# EAGLE design TestRig (EAGLE 6.5.0)
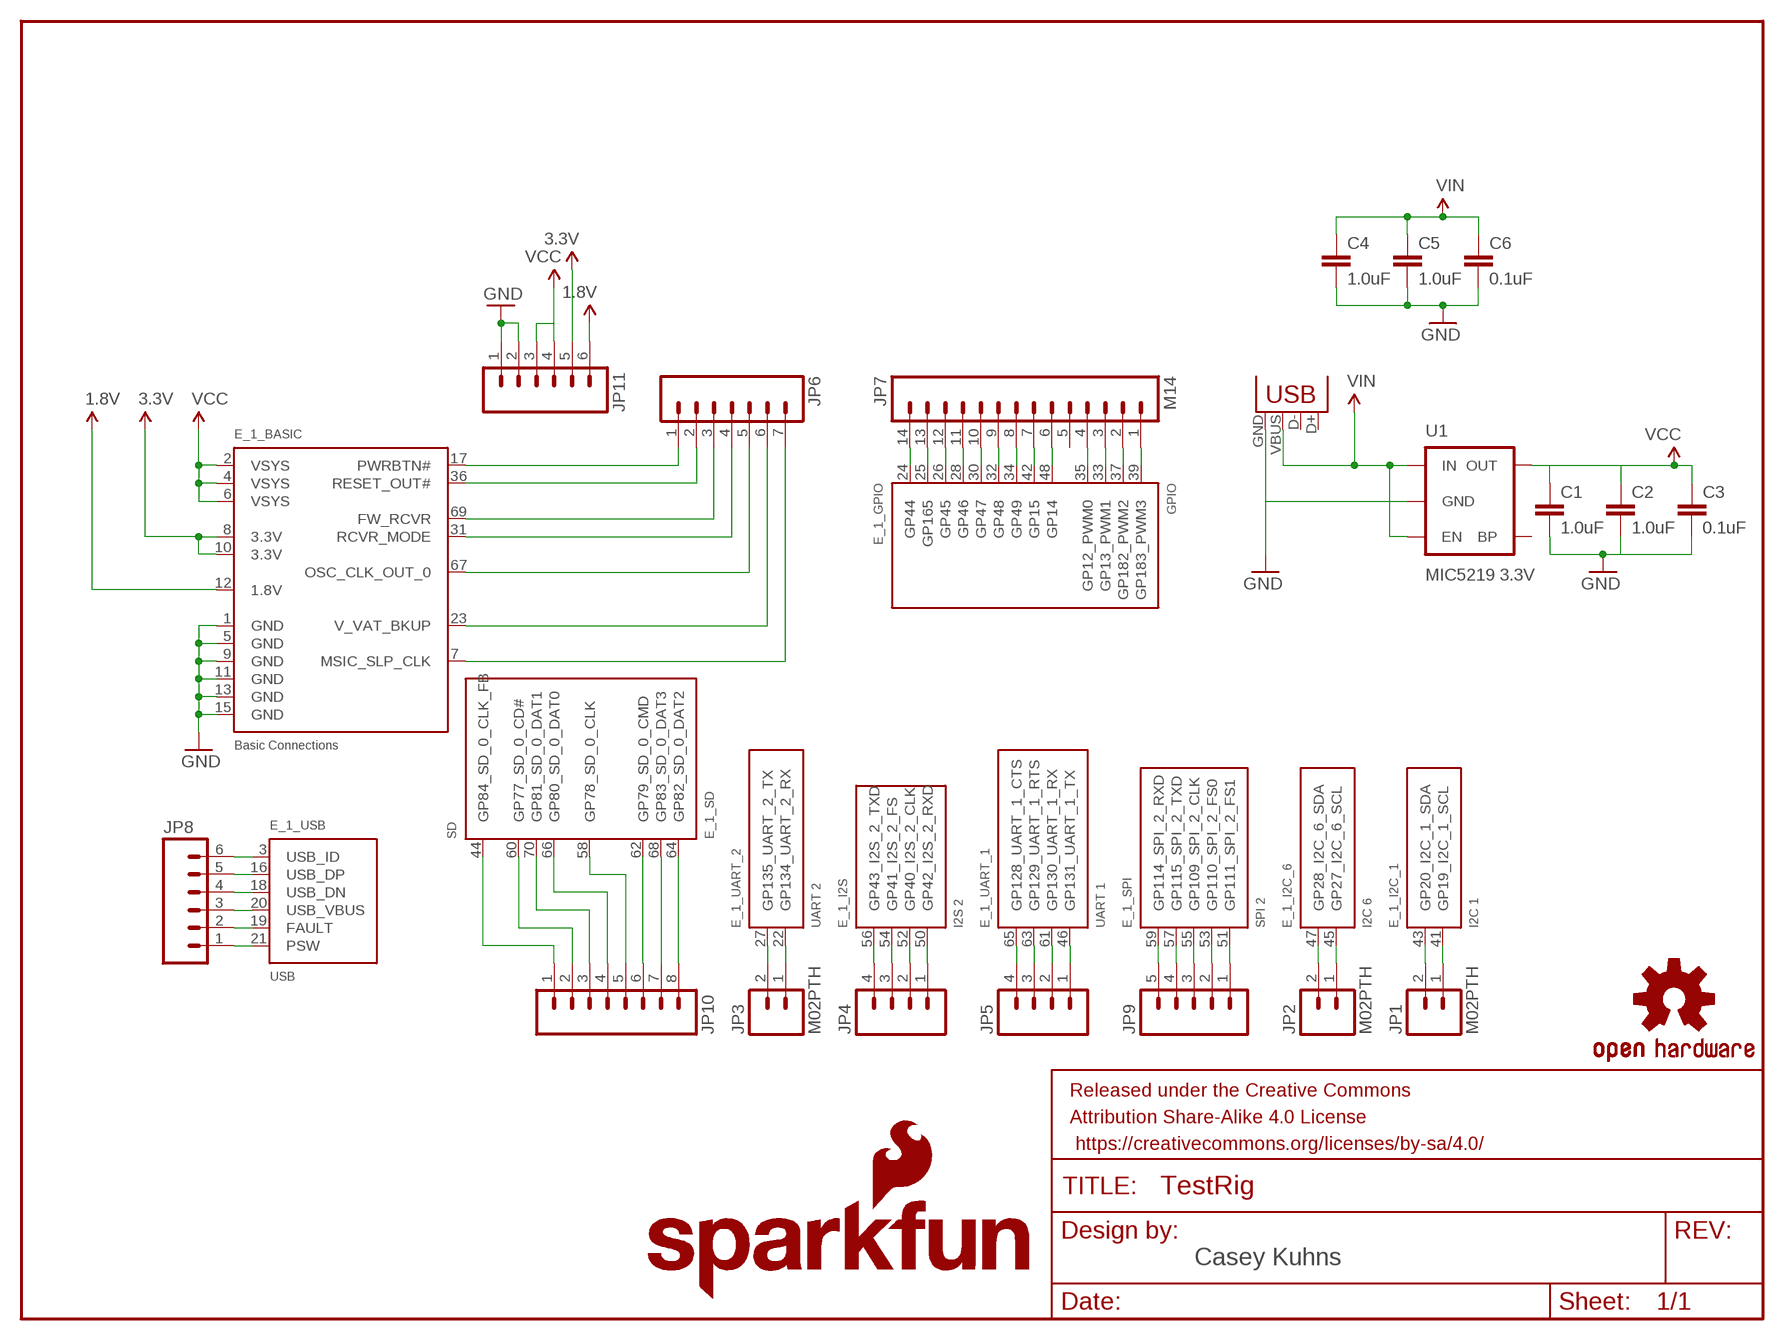
[diagram p0: schematic, sheet 1]

## Parts
C1  1.0uF  1.0UF-25V-+80/-20(0805)  [0805]
C2  1.0uF  1.0UF-25V-+80/-20(0805)  [0805]
C3  0.1uF  0.1UF-25V(+80/-20%)(0603)  [0603-CAP]
C4  1.0uF  1.0UF-25V-+80/-20(0805)  [0805]
C5  1.0uF  1.0UF-25V-+80/-20(0805)  [0805]
C6  0.1uF  0.1UF-25V(+80/-20%)(0603)  [0603-CAP]
E_1  EDISON_CONNECTOR_SEGMENTED  [EDISON_DAUGHTER]
FRAME1  FRAME-LETTER  [CREATIVE_COMMONS]
JP1  M02PTH  [1X02]
JP2  M02PTH  [1X02]
JP3  M02PTH  [1X02]
JP4  M04PTH  [1X04]
JP5  M04PTH  [1X04]
JP6  M07  [1X07]
JP7  M14  [1X14]
JP8  M06SIP  [1X06]
JP9  M05NO_SILK  [1X05_NO_SILK]
JP10  M081X08  [1X08]
JP11  M06SIP  [1X06]
JP12  USBSMD  [USB-MINIB]
LOGO1  SFE_LOGO_NAME_FLAME.1_INCH  [SFE_LOGO_NAME_FLAME_.1]
LOGO2  OSHW-LOGOS  [OSHW-LOGO-S]
U1  MIC5219 3.3V  V_REG_MIC52193.3V  [SOT23-5]

## Nets
1.8V: E_1.12(_BASIC:1.8V) JP11.6
3.3V: E_1.8(_BASIC:3.3V) E_1.10(_BASIC:3.3V) JP11.5
GND: C1.2 C2.2 C3.2 C4.2 C5.2 C6.2 E_1.1(_BASIC:GND) E_1.5(_BASIC:GND) E_1.9(_BASIC:GND) E_1.11(_BASIC:GND) E_1.13(_BASIC:GND) E_1.15(_BASIC:GND) JP11.1 JP11.2 JP12.GND U1.2(GND)
N$1: E_1.41(_I2C_1:GP19_I2C_1_SCL) JP1.1
N$2: E_1.43(_I2C_1:GP20_I2C_1_SDA) JP1.2
N$3: E_1.45(_I2C_6:GP27_I2C_6_SCL) JP2.1
N$4: E_1.47(_I2C_6:GP28_I2C_6_SDA) JP2.2
N$5: E_1.22(_UART_2:GP134_UART_2_RX) JP3.1
N$6: E_1.27(_UART_2:GP135_UART_2_TX) JP3.2
N$7: E_1.50(_I2S:GP42_I2S_2_RXD) JP4.1
N$8: E_1.52(_I2S:GP40_I2S_2_CLK) JP4.2
N$9: E_1.54(_I2S:GP41_I2S_2_FS) JP4.3
N$10: E_1.56(_I2S:GP43_I2S_2_TXD) JP4.4
N$11: E_1.46(_UART_1:GP131_UART_1_TX) JP5.1
N$12: E_1.61(_UART_1:GP130_UART_1_RX) JP5.2
N$13: E_1.63(_UART_1:GP129_UART_1_RTS) JP5.3
N$14: E_1.65(_UART_1:GP128_UART_1_CTS) JP5.4
N$15: E_1.17(_BASIC:PWRBTN#) JP6.1
N$16: E_1.36(_BASIC:RESET_OUT#) JP6.2
N$17: E_1.69(_BASIC:FW_RCVR) JP6.3
N$18: E_1.31(_BASIC:RCVR_MODE) JP6.4
N$19: E_1.67(_BASIC:OSC_CLK_OUT_0) JP6.5
N$20: E_1.23(_BASIC:V_VAT_BKUP) JP6.6
N$21: E_1.7(_BASIC:MSIC_SLP_CLK) JP6.7
N$22: E_1.39(_GPIO:GP183_PWM3) JP7.1
N$23: E_1.37(_GPIO:GP182_PWM2) JP7.2
N$24: E_1.33(_GPIO:GP13_PWM1) JP7.3
N$25: E_1.35(_GPIO:GP12_PWM0) JP7.4
N$26: E_1.48(_GPIO:GP14) JP7.6
N$27: E_1.42(_GPIO:GP15) JP7.7
N$28: E_1.34(_GPIO:GP49) JP7.8
N$29: E_1.32(_GPIO:GP48) JP7.9
N$30: E_1.30(_GPIO:GP47) JP7.10
N$31: E_1.28(_GPIO:GP46) JP7.11
N$32: E_1.26(_GPIO:GP45) JP7.12
N$33: E_1.25(_GPIO:GP165) JP7.13
N$34: E_1.24(_GPIO:GP44) JP7.14
N$35: E_1.21(_USB:PSW) JP8.1
N$36: E_1.19(_USB:FAULT) JP8.2
N$37: E_1.20(_USB:USB_VBUS) JP8.3
N$38: E_1.18(_USB:USB_DN) JP8.4
N$39: E_1.16(_USB:USB_DP) JP8.5
N$40: E_1.3(_USB:USB_ID) JP8.6
N$41: E_1.51(_SPI:GP111_SPI_2_FS1) JP9.1
N$42: E_1.53(_SPI:GP110_SPI_2_FS0) JP9.2
N$43: E_1.55(_SPI:GP109_SPI_2_CLK) JP9.3
N$44: E_1.57(_SPI:GP115_SPI_2_TXD) JP9.4
N$45: E_1.59(_SPI:GP114_SPI_2_RXD) JP9.5
N$46: E_1.64(_SD:GP82_SD_0_DAT2) JP10.8
N$47: E_1.68(_SD:GP83_SD_0_DAT3) JP10.7
N$48: E_1.62(_SD:GP79_SD_0_CMD) JP10.6
N$49: E_1.58(_SD:GP78_SD_0_CLK) JP10.5
N$50: E_1.66(_SD:GP80_SD_0_DAT0) JP10.4
N$51: E_1.70(_SD:GP81_SD_0_DAT1) JP10.3
N$52: E_1.60(_SD:GP77_SD_0_CD#) JP10.2
N$53: E_1.44(_SD:GP84_SD_0_CLK_FB) JP10.1
VCC: C1.1 C2.1 C3.1 E_1.2(_BASIC:VSYS) E_1.4(_BASIC:VSYS) E_1.6(_BASIC:VSYS) JP11.3 JP11.4 U1.5(OUT)
VIN: C4.1 C5.1 C6.1 JP12.VBUS U1.1(IN) U1.3(EN)
Unconnected: JP7.5 JP12.D+ JP12.D- U1.4(BP)

## Notes on the sheet
- Casey Kuhns

## Library data of the parts
C1 C2 C4 C5 = SparkFun-Capacitors:1.0UF-25V-+80/-20(0805): CAP-11625; PROD_ID: CAP-11625
C3 C6 = SparkFun-Capacitors:0.1UF-25V(+80/-20%)(0603): CAP-00810 Ceramic Standard decoupling cap; PROD_ID: CAP-00810
E_1 = Edison_Connectors:EDISON_CONNECTOR_SEGMENTED
FRAME1 = SparkFun-Aesthetics:FRAME-LETTER: Schematic Frame Standard 8.5x11 US Letter frame
JP1-JP3 = SparkFun-Connectors:M02: Standard 2-pin 0.1" header. Use with - straight break away headers ( PRT-00116) - right angle break away headers (PRT-00553) - swiss pins (PRT-00743) - machine pins (PRT-00117) - female headers (PRT-00115) Molex polarized connector foot print use with: PRT-08233 with associated crimp pins and housings. 2.54_SCREWTERM for use with PRT-10571. 3.5mm Screw Terminal footprints for PRT-08084 5mm Screw Terminal footprints for use with PRT-08433
JP4 JP5 = SparkFun-Connectors:M04: Header 4 Standard 4-pin 0.1" header. Use with straight break away headers (SKU : PRT-00116), right angle break away headers (PRT-00553), swiss pins (PRT-00743), machine pins (PRT-00117), and female headers (PRT-00115). Molex polarized connector foot print use with SKU : PRT-08231 with associated crimp pins and housings. 1MM SMD Version SKU: PRT-10208
JP6 = SparkFun-Connectors:M07: Header 7 Standard 7-pin 0.1" header. Use with straight break away headers (SKU : PRT-00116), right angle break away headers (PRT-00553), swiss pins (PRT-00743), machine pins (PRT-00117), and female headers (PRT-00115). NOTES ON THE VARIANTS LOCK and LOCK_LONGPADS... This footprint was designed to help hold the alignment of a through-hole component (i.e. 7-pin header) while soldering it into place. You may notice that each hole has been shifted either up or down by 0.005 of an inch from it's more standard position (which is usually a perfectly straight line). This slight alteration caused the pins (the squares in the middle) to touch the edges of the holes. Because they are alternating, it causes a "brace" to hold the header in place. 0.005 has proven to be the perfect amount of "off-center" position when using our standard breakaway headers. Although looks a little odd when you look at the bare footprint, once you have a header in there, the alteration is very hard to notice. Also, if you push a header all the way into place, it is covered up entirely on the bottom side. This idea of altering the position of holes to aid alignment will be further integrated into the Sparkfun Library for other footprints. It can help hold any component with 3 or more connection pins.
JP7 = SparkFun-Connectors:M14: Header 14 Standard 14-pin 0.1" header. Use with straight break away headers (SKU : PRT-00116), right angle break away headers (PRT-00553), swiss pins (PRT-00743), machine pins (PRT-00117), and female headers (PRT-00115).
JP8 JP11 = SparkFun-Connectors:M06: Header 6 Standard 6-pin 0.1" header. Use with straight break away headers (SKU : PRT-00116), right angle break away headers (PRT-00553), swiss pins (PRT-00743), machine pins (PRT-00117), and female headers (PRT-00115). Molex polarized connector foot print use with SKU : PRT-08094 with associated crimp pins and housings. NOTES ON THE VARIANTS LOCK and LOCK_LONGPADS... This footprint was designed to help hold the alignment of a through-hole component (i.e. 6-pin header) while soldering it into place. You may notice that each hole has been shifted either up or down by 0.005 of an inch from it's more standard position (which is a perfectly straight line). This slight alteration caused the pins (the squares in the middle) to touch the edges of the holes. Because they are alternating, it causes a "brace" to hold the component in place. 0.005 has proven to be the perfect amount of "off-center" position when using our standard breakaway headers. Although looks a little odd when you look at the bare footprint, once you have a header in there, the alteration is very hard to notice. Also,if you push a header all the way into place, it is covered up entirely on the bottom side. This idea of altering the position of holes to aid alignment will be further integrated into the Sparkfun Library for other footprints. It can help hold any component with 3 or more connection pins.
JP9 = SparkFun-Connectors:M05: Header 5 Standard 5-pin 0.1" header. Use with straight break away headers (SKU : PRT-00116), right angle break away headers (PRT-00553), swiss pins (PRT-00743), machine pins (PRT-00117), and female headers (PRT-00115). Molex polarized connector foot print use with SKU : PRT-08230 with associated crimp pins and housings.
JP10 = SparkFun-Connectors:M08: Header 8 Standard 8-pin 0.1" header. Use with straight break away headers (SKU : PRT-00116), right angle break away headers (PRT-00553), swiss pins (PRT-00743), machine pins (PRT-00117), and female headers (PRT-00115).
JP12 = SparkFun-Connectors:USB: USB Connectors USB-B-PTH is fully proven SKU : PRT-00139/CONN-08278 USB-miniB is fully proven SKU : PRT-00587 USB-A-PCB is untested. USB-A-H is throughly reviewed, but untested. Spark Fun Electronics SKU : PRT-00437 USB-B-SMT is throughly reviewed, but untested. Needs silkscreen touching up. USB-A-S has not been used/tested USB-MB-H has not been used/tested USB-MICROB has been used. CONN-09505; PROD_ID: CONN-08193
LOGO1 = SparkFun-Aesthetics:SFE_LOGO_NAME_FLAME: SFE Logo, name and flame This is the SparkFun full logo. The logo on the schematic will always be the same size; the package variant is the height of the flame part of the logo. Default layer for the logo on the board is tSilk.
LOGO2 = SparkFun-Aesthetics:OSHW-LOGO: Open Source Hardware Logo This logo indicates the piece of hardware it is found on incorporates a OSHW license and/or adheres to the definition of open source hardware found here: http://freedomdefined.org/OSHW
U1 = SparkFun-PowerIC:V_REG_MIC5219: V_REG MIC5219 Standard 3.3V and 5V 500mA LDO voltage regulator in SOT-23 layout. Micrel part MIC5219. BP (by-pass) pin is used to lower output noise with 470pF cap, may be left open.; PROD_ID: VREG-09872

## Board
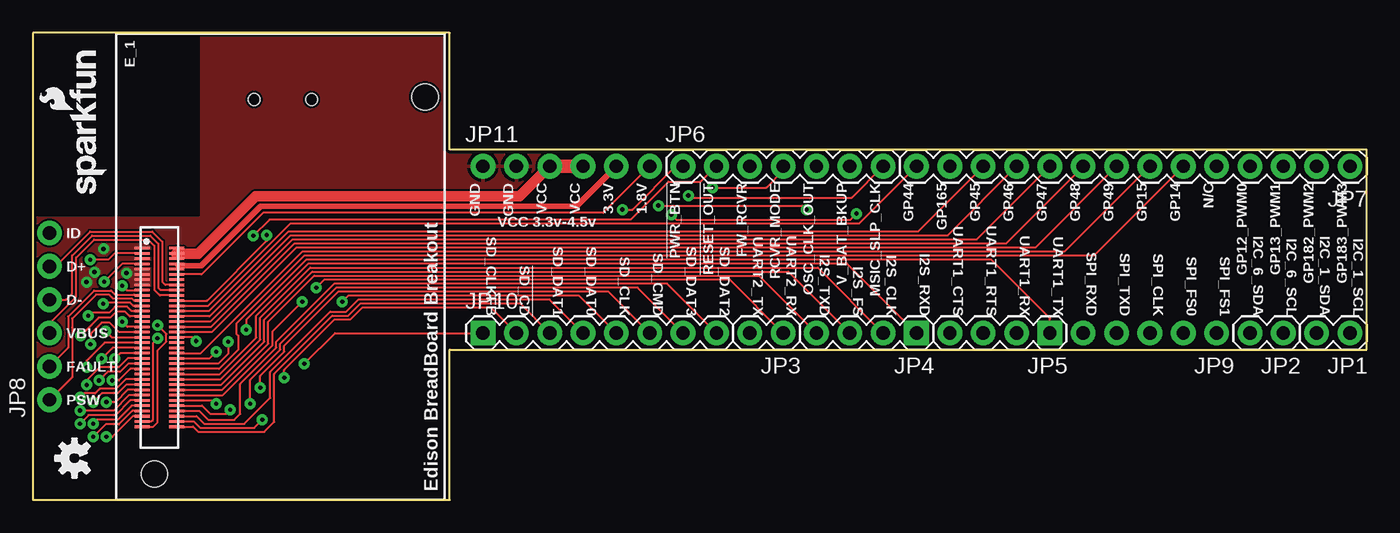
[diagram p1: board, top side]
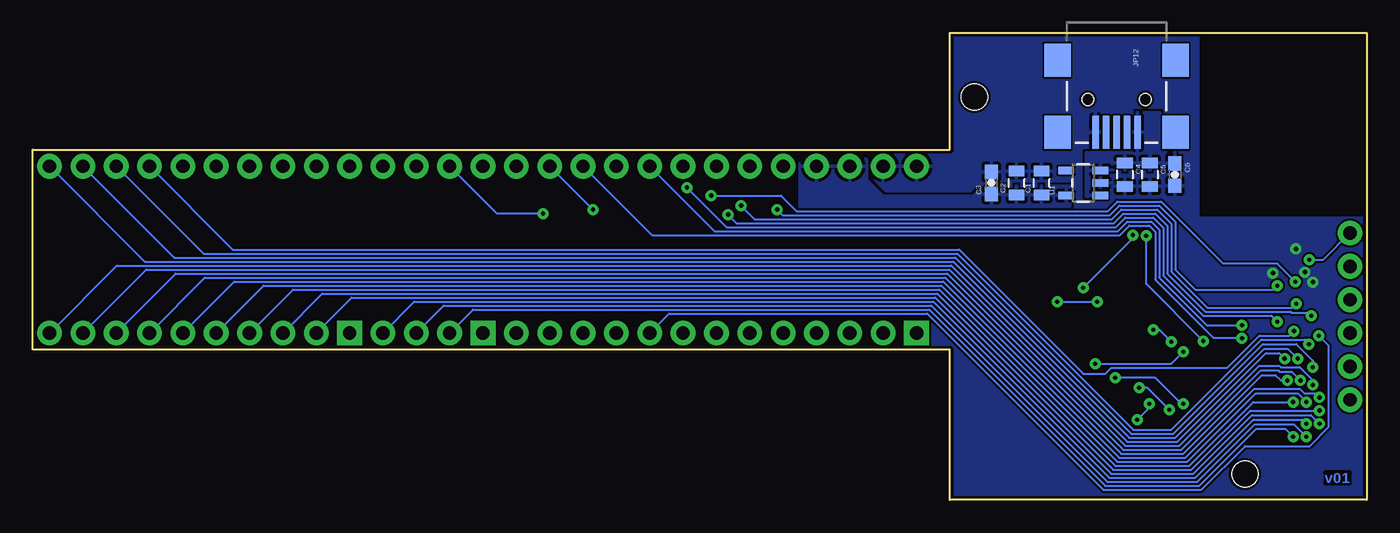
[diagram p2: board, bottom side, seen from below]

Size 101.6 x 35.56 mm. Coordinates in mm from the lower left corner, seen from the top.
Outline: 0,0 31.75,0 31.75,11.43 101.6,11.43 101.6,26.67 31.75,26.67 31.75,35.56 0,35.56 0,0
Copper layers (1*16): Top 0.035mm / dielectric 1.5mm / Bottom 0.035mm
Design rules "SparkFun-2-layer *": minimum track width 6mil, minimum drill 13mil, track to track 6mil, track to pad 6mil, pad to pad 6mil, via to via 6mil, smd to smd 6mil, copper to edge 8mil, drill to drill 8mil, minimum pad ring 12mil, minimum via ring 10mil, stop-mask expansion 4mil, vias tented up to drill 20mil, thermal gap 10mil
tRestrict: area 0,21.6 to 12.7,35.6
bRestrict: area 0,21.6 to 12.7,35.6

### Footprints (pad centres in the part's own frame; a part is rotated, then mirrored left to right if it is on the bottom)
0805 = smd 0.8 x 1.2: 1 -0.9,0; 2 0.9,0
0603-CAP = smd 1.1 x 1: 1 -0.85,0; 2 0.85,0
EDISON_DAUGHTER = smd 1.14 x 0.2: 1 1.98,19.17; 2 4.62,19.17; 3 1.98,18.77; 4 4.62,18.77; 5 1.98,18.37; 6 4.62,18.37; 7 1.98,17.97; 8 4.62,17.97; 9 1.98,17.57; 10 4.62,17.57; 11 1.98,17.17; 12 4.62,17.17; 13 1.98,16.77; 14 4.62,16.77; 15 1.98,16.37; 16 4.62,16.37; 17 1.98,15.97; 18 4.62,15.97; 19 1.98,15.57; 20 4.62,15.57; 21 1.98,15.17; 22 4.62,15.17; 23 1.98,14.77; 24 4.62,14.77; 25 1.98,14.37; 26 4.62,14.37; 27 1.98,13.97; 28 4.62,13.97; 29 1.98,13.57; 30 4.62,13.57; 31 1.98,13.17; 32 4.62,13.17; 33 1.98,12.77; 34 4.62,12.77; 35 1.98,12.37; 36 4.62,12.37; 37 1.98,11.97; 38 4.62,11.97; 39 1.98,11.57; 40 4.62,11.57; 41 1.98,11.17; 42 4.62,11.17; 43 1.98,10.77; 44 4.62,10.77; 45 1.98,10.37; 46 4.62,10.37; 47 1.98,9.97; 48 4.62,9.97; 49 1.98,9.57; 50 4.62,9.57; 51 1.98,9.17; 52 4.62,9.17; 53 1.98,8.77; 54 4.62,8.77; 55 1.98,8.37; 56 4.62,8.37; 57 1.98,7.97; 58 4.62,7.97; 59 1.98,7.57; 60 4.62,7.57; 61 1.98,7.17; 62 4.62,7.17; 63 1.98,6.77; 64 4.62,6.77; 65 1.98,6.37; 66 4.62,6.37; 67 1.98,5.97; 68 4.62,5.97; 69 1.98,5.57; 70 4.62,5.57 | hole 2: 23.53,30.67; 2.93,1.98
1X02 = drill 1.016 pad 1.88: 1 0,0; 2 2.54,0
1X04 = drill 1.016 pad 1.88 square: 1 0,0 | drill 1.016 pad 1.88: 2 2.54,0; 3 5.08,0; 4 7.62,0
1X07 = drill 1.016 pad 1.88: 1 0,0; 2 2.54,0; 3 5.08,0; 4 7.62,0; 5 10.16,0; 6 12.7,0; 7 15.24,0
1X14 = drill 1.016 pad 1.88: 1 0,0; 2 2.54,0; 3 5.08,0; 4 7.62,0; 5 10.16,0; 6 12.7,0; 7 15.24,0; 8 17.78,0; 9 20.32,0; 10 22.86,0; 11 25.4,0; 12 27.94,0; 13 30.48,0; 14 33.02,0
1X06 = drill 1.016 pad 1.88: 1 0,0; 2 2.54,0; 3 5.08,0; 4 7.62,0; 5 10.16,0; 6 12.7,0
1X05_NO_SILK = drill 1.016 pad 1.88: 1 0,0; 2 2.54,0; 3 5.08,0; 4 7.62,0; 5 10.16,0
1X08 = drill 1.016 pad 1.88 square: 1 0,0 | drill 1.016 pad 1.88: 2 2.54,0; 3 5.08,0; 4 7.62,0; 5 10.16,0; 6 12.7,0; 7 15.24,0; 8 17.78,0
USB-MINIB = smd 2.5 x 0.5: D+ 2.5,0; D- 2.5,0.8; GND 2.5,-1.6; ID 2.5,-0.8; VBUS 2.5,1.6 | smd 2.5 x 2: MTN1 -3,4.5; MTN2 2.5,4.5; MTN3 -3,-4.5; MTN4 2.5,-4.5 | hole 0.9: 0,2.2; 0,-2.2
SOT23-5 = smd 0.55 x 1.2: 1 -0.95,-1.3; 2 0,-1.3; 3 0.95,-1.3; 4 0.95,1.3; 5 -0.95,1.3

### Placement (x,y rotation side)
C1  24.77,24.13 90 bottom
C2  26.67,24.13 90 bottom
C3  28.57,24.13 90 bottom
C4  18.41,24.77 270 bottom
C5  16.51,24.77 270 bottom
C6  14.61,24.77 270 bottom
E_1  6.35,0 0 top
FRAME1  0,-10.16 0 top  (outside the outline)
JP1  100.33,12.7 180 top
JP2  95.25,12.7 180 top
JP3  57.15,12.7 180 top
JP4  67.31,12.7 180 top
JP5  77.47,12.7 180 top
JP6  49.53,25.4 0 top
JP7  100.33,25.4 180 top
JP8  1.27,7.62 90 top
JP9  90.17,12.7 180 top
JP10  34.29,12.7 0 top
JP11  34.29,25.4 0 top
JP12  19.05,30.48 270 bottom
LOGO1  5.71,22.86 90 top
LOGO2  3.17,3.17 90 top
U1  21.59,24.13 90 bottom

### Tracks (layer width: path | path; a pad name or v marks a point on that pad's centre or on a via)
1.8V
  Top 0.152: JP11.6 43.43,21.84 17.53,21.84 12.85,17.17 E_1.12
3.3V
  Top 0.152: E_1.8 E_1.10 | E_1.8 10.97,17.83 | E_1.8 10.97,17.93 11.07,17.83
  Top 0.406: JP11.5 41.4,22.35 17.35,22.35 12.83,17.83 11.07,17.83
GND  (via drill 0.33)
  other vias: 5.38,19.1 7.14,17.27 4.7,17.35 4.09,16.59
  pour Top (no thermals): 7.11,19.56 9.4,19.56 9.4,15.75 7.11,15.75
  pour Top: 0,0 31.75,0 31.75,11.43 101.6,11.43 101.6,26.67 31.75,26.67 31.75,35.56 0,35.56
  pour Bottom (rank 6): 0,-0.05 31.75,-0.05 31.75,11.38 101.6,11.38 101.6,26.62 31.75,26.62 31.75,35.51 0,35.51
N$1  (via drill 0.33)
  Top 0.152: E_1.41 6.67,11.17 v6.25,10.75
  Bottom 0.152: JP1.1 95.2,17.83 31.65,17.83 18.24,4.42 14.43,4.42 7.68,11.17 6.67,11.17 v6.25,10.75
N$2  (via drill 0.33)
  Top 0.152: E_1.43 7.22,10.77 6.55,10.1 5.1,10.1 4.1,9.1 v4.1,8.75
  Bottom 0.152: JP1.2 92.96,17.53 31.8,17.53 18.39,4.12 14.28,4.12 8.19,10.2 6.65,10.2 6.55,10.1 5.1,10.1 4.1,9.1 v4.1,8.75
N$3  (via drill 0.33)
  Top 0.152: E_1.45 7.27,10.37 6.65,9.75 5.7,9.75 v5.05,9.1
  Bottom 0.152: JP2.1 90.73,17.22 31.95,17.22 18.54,3.81 14.12,3.81 8.08,9.85 6.75,9.85 6.65,9.75 5.7,9.75 v5.05,9.1
N$4  (via drill 0.33)
  Top 0.152: E_1.47 7.42,9.97 6.55,9.1 v6.05,9.1
  Bottom 0.152: JP2.2 88.49,16.92 32.11,16.92 18.69,3.5 13.97,3.5 7.97,9.5 6.95,9.5 6.55,9.1 v6.05,9.1
N$5  (via drill 0.33)
  Top 0.152: E_1.22 13.27,15.17 17.82,19.71 v17.82,20.15 | JP3.1 53.09,16.76 22.2,16.76 v21.59,16.15
  Bottom 0.152: v17.82,20.15 17.82,19.93 v21.59,16.15
N$6  (via drill 0.33)
  Top 0.152: E_1.27 7.39,13.97 7.04,14.33 6.35,14.33 5.89,13.87 5.02,13.87 v3.65,12.5
  Bottom 0.152: JP3.2 53.14,14.17 33.48,14.17 20.07,0.76 12.6,0.76 9.26,4.1 4.35,4.1 2.9,5.55 2.9,11.75 v3.65,12.5
N$7
  Top 0.152: E_1.50 14.24,9.57 17.02,12.34 17.02,14.02 20.98,17.98 62.03,17.98 JP4.1
N$8
  Top 0.152: E_1.52 14.3,9.17 17.32,12.19 17.32,13.87 21.13,17.68 59.79,17.68 JP4.2
N$9
  Top 0.152: E_1.54 14.36,8.77 17.63,12.04 17.63,13.72 21.29,17.37 57.56,17.37 JP4.3
N$10
  Top 0.152: E_1.56 14.41,8.37 17.93,11.89 17.93,13.56 21.44,17.07 55.32,17.07 JP4.4
N$11  (via drill 0.33)
  Top 0.152: JP5.1 77.47,13.82 73,18.29 20.83,18.29 16.26,13.72 v16.26,12.95 | E_1.46 14.13,10.37 14.88,11.12 v14.88,12.04
  Bottom 0.152: v16.26,12.95 15.8,12.95 v14.88,12.04
N$12  (via drill 0.33)
  Top 0.152: E_1.61 7.52,7.17 6.45,6.1 4.9,6.1 v4.6,5.8
  Bottom 0.152: JP5.2 72.54,15.09 33.02,15.09 19.61,1.68 13.06,1.68 8.63,6.1 4.9,6.1 v4.6,5.8
N$13  (via drill 0.33)
  Top 0.152: E_1.63 7.57,6.77 6.55,5.75 5.55,5.75 v4.6,4.8
  Bottom 0.152: JP5.3 70.31,14.78 33.17,14.78 19.76,1.37 12.9,1.37 8.53,5.75 5.55,5.75 v4.6,4.8
N$14  (via drill 0.33)
  Top 0.152: E_1.65 7.62,6.37 6.05,4.8 v5.6,4.8
  Bottom 0.152: JP5.4 68.07,14.48 33.33,14.48 19.91,1.07 12.75,1.07 8.42,5.4 6.2,5.4 v5.6,4.8
N$15  (via drill 0.33)
  Top 0.152: v44.91,22.1 45.67,22.1 48.97,25.4 JP6.1 | v6.81,16.31 7.14,15.97 E_1.17
  Bottom 0.152: v44.91,22.1 44.45,21.64 19.61,21.64 18.85,22.4 15.8,22.4 14.58,21.18 14.58,17.53 13.06,16 7.11,16 v6.81,16.31
N$16  (via drill 0.33)
  Top 0.152: v12.45,12.09 12.16,12.37 E_1.36 | v16.8,20.1 18.03,21.34 45.52,21.34 48.41,24.23 50.85,24.23 52.07,25.45 JP6.2
  Bottom 0.152: v12.45,12.09 16.8,16.44 v16.8,20.1
N$17  (via drill 0.33)
  Top 0.152: 7.91,5.57 E_1.69 9.17,5.57 9.5,5.9 9.5,11.38 10.16,12.04 10.16,12.64 v9.5,13.3
  Bottom 0.152: JP6.3 49.63,20.42 19,20.42 18.24,21.18 16.41,21.18 15.8,20.57 15.8,16.92 12.18,13.3 v9.5,13.3
N$18  (via drill 0.33)
  Top 0.152: v51.77,23.77 55.88,23.77 57.15,25.04 JP6.4 | E_1.31 7.2,13.17 v6.81,13.56
  Bottom 0.152: v51.77,23.77 48.72,20.73 19.15,20.73 18.39,21.49 16.26,21.49 15.49,20.73 15.49,17.07 12.45,14.02 7.26,14.02 v6.81,13.56
N$19  (via drill 0.33)
  Top 0.152: E_1.67 9.02,5.97 9.15,6.1 9.15,11.95 v9.5,12.3
  Bottom 0.152: JP6.5 54.41,20.12 18.85,20.12 18.09,20.88 16.56,20.88 16.1,20.42 16.1,16.76 11.68,12.34 9.54,12.34 v9.5,12.3
N$20  (via drill 0.33)
  Top 0.152: E_1.23 7.66,14.77 7.42,15.01 5.44,15.01 v5.36,14.94 | v47.65,22.4 58.62,22.4 v58.93,22.1
  Bottom 0.152: v58.93,22.1 JP6.6 | v47.65,22.4 46.58,21.34 19.46,21.34 18.69,22.1 15.95,22.1 14.88,21.03 14.88,17.37 12.14,14.63 5.66,14.63 v5.36,14.94
N$21  (via drill 0.33)
  Top 0.152: JP6.7 62.38,23.01 50.09,23.01 v49.94,23.16 | E_1.7 6.79,17.97 v5.44,16.61
  Bottom 0.152: v49.94,23.16 44.6,23.16 43.38,21.95 19.76,21.95 19,22.71 15.65,22.71 10.92,17.98 6.81,17.98 v5.44,16.61
N$22  (via drill 0.33)
  Top 0.152: E_1.39 6.07,11.57 v5.25,10.75
  Bottom 0.152: JP7.1 93.07,18.14 31.5,18.14 18.09,4.72 14.58,4.72 7.8,11.5 6,11.5 v5.25,10.75
N$23  (via drill 0.33)
  Top 0.152: E_1.37 5.47,11.97 4.1,10.6 v4.1,10.1
  Bottom 0.152: JP7.2 90.83,18.44 31.34,18.44 17.93,5.03 14.73,5.03 7.91,11.85 5.35,11.85 4.1,10.6 v4.1,10.1
N$24  (via drill 0.33)
  Top 0.152: E_1.33 6.57,12.77 5.84,13.5 5.24,13.5 4.4,12.66 v4.4,11.85
  Bottom 0.152: JP7.3 88.59,18.75 31.19,18.75 17.78,5.33 14.88,5.33 8.03,12.19 4.71,12.19 4.4,11.88 v4.4,11.85
N$25  (via drill 0.33)
  Top 0.152: v5.54,12.85 6.02,12.37 E_1.35
  Bottom 0.152: JP7.4 86.36,19.05 31.04,19.05 21.59,9.6 19.91,9.6 19.46,10.06 10.62,10.06 8.18,12.5 5.89,12.5 v5.54,12.85
N$26
  Top 0.152: E_1.48 14.19,9.97 15.65,11.43 15.65,12.5 15.49,12.65 15.49,13.41 20.68,18.59 80.82,18.59 JP7.6
N$27
  Top 0.152: JP7.7 78.59,18.9 20.52,18.9 12.8,11.17 E_1.42
N$28
  Top 0.152: JP7.8 76.35,19.2 20.07,19.2 13.63,12.77 E_1.34
N$29
  Top 0.152: JP7.9 74.12,19.51 19.91,19.51 13.58,13.17 E_1.32
N$30
  Top 0.152: JP7.10 71.88,19.81 19.76,19.81 13.52,13.57 E_1.30
N$31
  Top 0.152: JP7.11 69.65,20.12 19.61,20.12 13.46,13.97 E_1.28
N$32
  Top 0.152: JP7.12 67.41,20.42 19.46,20.42 13.4,14.37 E_1.26
N$33  (via drill 0.33)
  Top 0.152: v48.64,21.72 49.02,21.34 62.28,21.34 v62.74,21.79 | E_1.25 7.53,14.37 7.19,14.71 6.27,14.71 5.82,14.25 4.45,14.25 v4.22,14.02
  Bottom 0.152: JP7.13 66.24,21.79 v62.74,21.79 | v48.64,21.72 47.95,21.03 19.3,21.03 18.54,21.79 16.1,21.79 15.19,20.88 15.19,17.22 12.29,14.33 5.82,14.33 5.74,14.25 4.45,14.25 v4.22,14.02
N$34
  Top 0.152: JP7.14 62.94,21.03 19.61,21.03 13.35,14.77 E_1.24
N$35
  Top 0.152: 3,13.11 | 3,13.11 3,9.35 JP8.1 | E_1.21 7.71,15.17 7.57,15.32 6.12,15.32 5.82,15.62 4.83,15.62 3,13.79 3,13.11
N$36
  Top 0.152: JP8.2 2.69,11.58 2.69,13.95 4.67,15.93 5.97,15.93 6.27,15.62 7.72,15.62 7.77,15.57 E_1.19
N$37
  Top 0.152: E_1.20 9.68,15.57 9.25,16 9.25,19.36 8.79,19.81 4.67,19.81 3.3,18.44 3.3,15.47 1.27,13.44 JP8.3
N$38
  Top 0.152: JP8.4 2.54,15.24 3,15.7 3,18.59 4.52,20.12 8.94,20.12 9.55,19.51 9.55,16.15 9.73,15.97 E_1.18
N$39
  Top 0.152: JP8.5 1.73,17.78 4.37,20.42 9.09,20.42 9.86,19.66 9.86,16.61 10.1,16.37 E_1.16
N$40  (via drill 0.33)
  Top 0.152: E_1.3 6.22,18.77 5.74,18.29 v4.37,18.29
  Bottom 0.152: v4.37,18.29 3.3,18.29 JP8.6
N$41  (via drill 0.33)
  Top 0.152: E_1.51 7.07,9.17 6.35,8.45 5.1,8.45 4.75,8.1 3.9,8.1 v3.6,7.8
  Bottom 0.152: JP9.1 86.26,16.61 32.26,16.61 18.85,3.2 13.82,3.2 8.57,8.45 5.1,8.45 4.75,8.1 3.9,8.1 v3.6,7.8
N$42  (via drill 0.33)
  Top 0.152: E_1.53 7.12,8.77 6.45,8.1 5.25,8.1 v4.6,7.45
  Bottom 0.152: JP9.2 84.02,16.31 32.41,16.31 19,2.9 13.66,2.9 8.46,8.1 5.25,8.1 v4.6,7.45
N$43  (via drill 0.33)
  Top 0.152: E_1.55 7.22,8.37 6.3,7.45 v5.6,7.45
  Bottom 0.152: JP9.3 81.79,16 32.56,16 19.15,2.59 13.51,2.59 8.65,7.45 v5.6,7.45
N$44  (via drill 0.33)
  Top 0.152: E_1.57 7.32,7.97 6.15,6.8 v3.6,6.8
  Bottom 0.152: JP9.4 79.55,15.7 32.72,15.7 19.3,2.29 13.36,2.29 8.85,6.8 v3.6,6.8
N$45  (via drill 0.33)
  Top 0.152: E_1.59 7.42,7.57 6.3,6.45 4.25,6.45 v3.6,5.8
  Bottom 0.152: JP9.5 77.32,15.39 32.87,15.39 19.46,1.98 13.21,1.98 8.74,6.45 4.25,6.45 v3.6,5.8
N$46
  Top 0.152: JP10.8 48.31,16.46 22.96,16.46 18.54,12.04 18.54,11.58 15.8,8.84 15.8,6.55 15.34,6.1 13.36,6.1 12.69,6.77 E_1.64
N$47  (via drill 0.33)
  Top 0.152: JP10.7 46.08,16.15 23.11,16.15 18.85,11.89 18.85,11.43 16.56,9.14 v16.56,7.32 | E_1.68 12.27,5.97 12.75,5.49 16.87,5.49 v17.48,6.1
  Bottom 0.152: v17.48,6.1 16.56,7.01 v16.56,7.32
N$48  (via drill 0.33)
  Top 0.152: JP10.6 43.84,15.85 23.27,15.85 19.15,11.73 19.15,11.28 17.32,9.45 v17.32,8.53 | E_1.62 12.9,7.17 13.51,6.55 14.73,6.55 v15.04,6.86
  Bottom 0.152: v15.04,6.86 16.71,8.53 v17.32,8.53
N$49  (via drill 0.33)
  Top 0.152: JP10.5 41.6,15.54 24.03,15.54 v23.57,15.09 | E_1.58 14.47,7.97 18.24,11.73 18.24,12.8 v20.52,15.09
  Bottom 0.152: v23.57,15.09 v20.52,15.09
N$50
  Top 0.152: JP10.4 39.37,15.24 24.79,15.24 23.88,14.33 22.66,14.33 18.09,9.75 18.09,7.77 16.1,5.79 13.06,5.79 12.48,6.37 E_1.66
N$51
  Top 0.152: JP10.3 37.13,14.94 24.94,14.94 24.03,14.02 22.81,14.02 18.39,9.6 18.39,5.94 17.63,5.18 12.6,5.18 12.21,5.57 E_1.70
N$52  (via drill 0.33)
  Top 0.152: JP10.2 34.9,14.63 25.09,14.63 24.18,13.72 22.96,13.72 19.15,9.91 v19.15,9.3 | E_1.60 13.71,7.57 v13.97,7.32
  Bottom 0.152: v13.97,7.32 14.12,7.32 16.1,9.3 v19.15,9.3
N$53  (via drill 0.33)
  Top 0.152: E_1.44 13.46,10.77 v13.97,11.28 | JP10.1 23.01,12.7 v20.68,10.36
  Bottom 0.152: v20.68,10.36 14.88,10.36 v13.97,11.28
VCC
  Top 0.152: E_1.6 E_1.4 E_1.2 10.97,18.79 10.92,18.75
  Top 0.813: JP11.3 37.08,23.11 16.97,23.11 12.6,18.75 10.92,18.75
  Top 1.016: JP11.3 JP11.4
  pour Bottom: 22.61,23.88 29.21,23.88 29.97,23.11 36.83,23.11 38.1,24.38 38.1,25.91 38.61,26.42 42.42,26.42 43.18,25.65 43.18,22.35 22.61,22.35
VIN
  pour Bottom: 19.81,23.37 19.81,23.11 21.34,23.11 21.34,26.42 18.03,26.42 18.03,29.46 15.75,29.46 15.75,26.42 14.22,26.42 14.22,25.15 21.08,25.15 21.08,23.37

### Text on the board
Bottom: v01
tPlace: GND | GND | VCC | VCC | 3.3V | 1.8V | !PWR_BTN | !RESET_OUT | FW_RCVR | RCVR_MODE | OSC_CLK_OUT | V_BAT_BKUP | MSIC_SLP_CLK | GP44 | GP165 | GP45 | GP46 | GP47 | GP48 | GP49 | GP15 | GP14 | N/C | GP12_PWM0 | GP13_PWM1 | GP182_PWM2 | GP183_PWM3 | VCC 3.3v-4.5v | ID | D+ | D- | SD_CLKFB | !SD_CD | SD_DAT1 | SD_DAT0 | SD_CLK | SD_CMD | SD_DAT3 | SD_DAT2 | UART2_TX | UART2_RX | I2S_TXD | I2S_FS | I2S_CLK | I2S_RXD | UART1_CTS | UART1_RTS | UART1_RX | UART1_TX | SPI_RXD | SPI_TXD | SPI_CLK | SPI_FS0 | SPI_FS1 | I2C_6_SDA | I2C_6_SCL | I2C_1_SDA | I2C_1_SCL | VBUS | FAULT | PSW | Edison BreadBoard Breakout
tDocu: Casey Kuhns